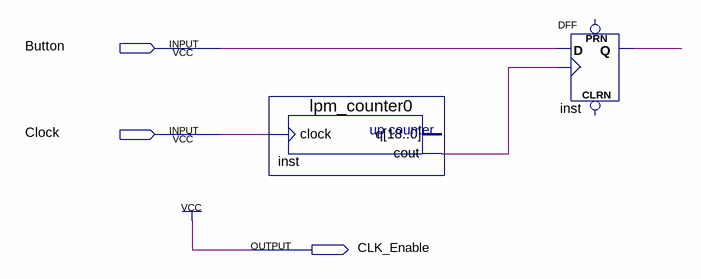
[diagram p0: schematic sheet]
// Quartus schematic lab4_Anticlicker.bdf as structural Verilog: 2 symbols, 3 pins
module lab4_Anticlicker (
  input  Button,
  input  Clock,
  output CLK_Enable
);

  wire inst_cout, inst_q;

  lpm_counter0 inst (.clock(Clock), .cout(inst_cout));  // open: q
  DFF inst_dup2 (.CLK(inst_cout), .D(Button), .Q(inst_q));  // open: CLRN, PRN

  assign CLK_Enable = 1'b1;
endmodule
